# Altium project Jackson.PrjPcb (part 2 of 2)

## Sheet USB Audio.SchDoc
size 420 x 297 mm; SheetNumber: 7; SheetTotal: 7
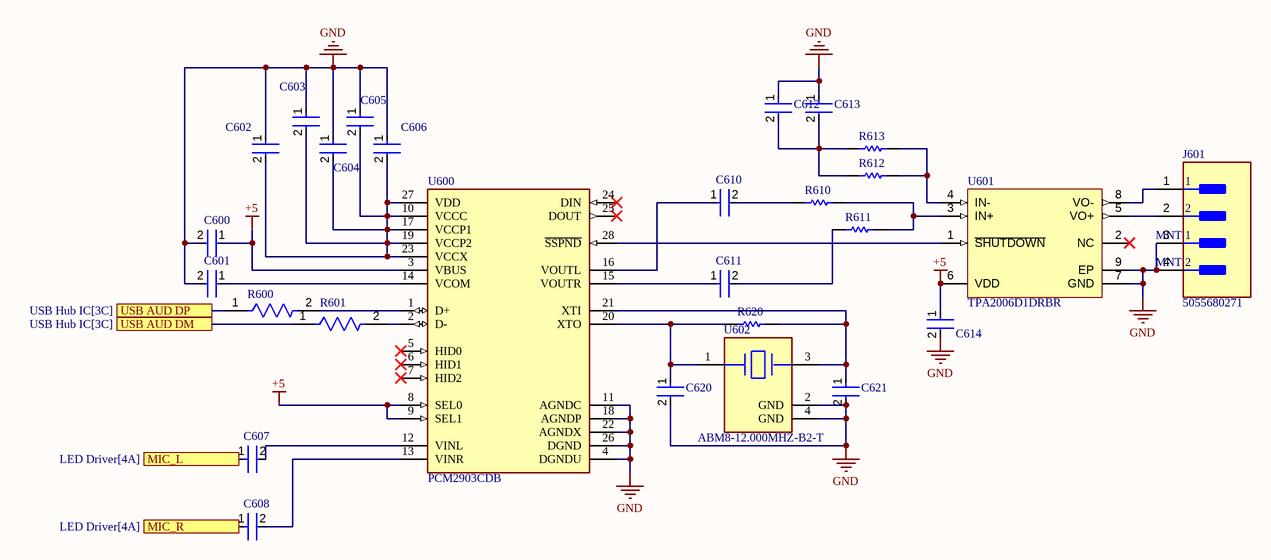
[diagram p6: USB Audio.SchDoc]

### Parts
C600  GRM155R70J105KA12D  [FP-GRM155-0_05-MFG]  (value not drawn)
C601  GRM155R70J105KA12D  [FP-GRM155-0_05-MFG]  (value not drawn)
C602  GRM155R70J105KA12D  [FP-GRM155-0_05-MFG]  (value not drawn)
C603  GRM155R70J105KA12D  [FP-GRM155-0_05-MFG]  (value not drawn)
C604  GRM155R70J105KA12D  [FP-GRM155-0_05-MFG]  (value not drawn)
C605  GRM155R70J105KA12D  [FP-GRM155-0_05-MFG]  (value not drawn)
C606  GRM155R70J105KA12D  [FP-GRM155-0_05-MFG]  (value not drawn)
C607  C0402C103K3RACTU  [FP-C0402-BB-MFG]  (value not drawn)
C608  C0402C103K3RACTU  [FP-C0402-BB-MFG]  (value not drawn)
C610  C0402C103K3RACTU  [FP-C0402-BB-MFG]  (value not drawn)
C611  C0402C103K3RACTU  [FP-C0402-BB-MFG]  (value not drawn)
C612  C0402C103K3RACTU  [FP-C0402-BB-MFG]  (value not drawn)
C613  C0402C103K3RACTU  [FP-C0402-BB-MFG]  (value not drawn)
C614  GRM155R70J105KA12D  [FP-GRM155-0_05-MFG]  (value not drawn)
C620  GJM1555C1H180JB01D  [FP-GJM155-0_05-IPC_B]  (value not drawn)
C621  GJM1555C1H180JB01D  [FP-GJM155-0_05-IPC_B]  (value not drawn)
J601  5055680271  [FP-5055680271-MFG]
R600  ERJ-2RKF27R0X  [FP-ERJ2R-IPC_B]  (value not drawn)
R601  ERJ-2RKF27R0X  [FP-ERJ2R-IPC_B]  (value not drawn)
R610  ERA2AEB683X  [RESC1005X40X25LL10T10]  (value not drawn)
R611  ERA2AEB683X  [RESC1005X40X25LL10T10]  (value not drawn)
R612  ERA2AEB683X  [RESC1005X40X25LL10T10]  (value not drawn)
R613  ERA2AEB683X  [RESC1005X40X25LL10T10]  (value not drawn)
R620  ERJ-2RKF1004X  [RESC1005X40X25LL05T05]  (value not drawn)
U600  PCM2903CDB  [FP-DB0028A-IPC_A]
U601  TPA2006D1DRBR  [DRB0008A_V]
U602  ABM8-12.000MHZ-B2-T  [FP-ABM8-MFG]

### Ports
MIC_L (see LED Driver[4A]), MIC_R (see LED Driver[4A]), USB AUD DM (see USB Hub IC[3C]), USB AUD DP (see USB Hub IC[3C])

### Nets
+5: C600.1 C614.1 U600.3(VBUS) U600.8(SEL0) U600.9(SEL1) U601.6(VDD)
GND: C600.2 C601.2 C602.1 C603.1 C604.1 C605.1 C606.1 C612.1 C613.1 C614.2 C620.2 C621.2 J601.3(MNT_1) J601.4(MNT_2) U600.4(DGNDU) U600.11(AGNDC) U600.18(AGNDP) U600.22(AGNDX) U600.26(DGND) U601.7(GND) U601.9(EP) U602.2(GND) U602.4(GND)
NetC601_1: C601.1 U600.14(VCOM)
NetC602_2: C602.2 C603.2 C604.2 C605.2 C606.2 U600.10(VCCC) U600.17(VCCP1) U600.19(VCCP2) U600.23(VCCX) U600.27(VDD)
NetC607_1: C607.1 ; port MIC_L
NetC607_2: C607.2 U600.12(VINL)
NetC608_1: C608.1 ; port MIC_R
NetC608_2: C608.2 U600.13(VINR)
NetC610_1: C610.1 U600.16(VOUTL)
NetC610_2: C610.2 R610.1
NetC611_1: C611.1 U600.15(VOUTR)
NetC611_2: C611.2 R611.1
NetC612_2: C612.2 C613.2 R612.1 R613.1
NetC620_1: C620.1 R620.1 U600.20(XTO) U602.1
NetC621_1: C621.1 R620.2 U600.21(XTI) U602.3
NetJ601_1: J601.1 U601.8(VO-)
NetJ601_2: J601.2 U601.5(VO+)
NetR600_1: R600.1 ; port USB AUD DP
NetR600_2: R600.2 U600.1(D+)
NetR601_1: R601.1 ; port USB AUD DM
NetR601_2: R601.2 U600.2(D-)
NetR610_2: R610.2 R611.2 U601.3(IN+)
NetR612_2: R612.2 R613.2 U601.4(IN-)
NetU600_28: U600.28(~{SSPND}) U601.1(~{SHUTDOWN})

Not connected (* = marked no-connect by the designer): U600 5(HID0)* 6(HID1)* 7(HID2)* 24(DIN)* 25(DOUT)*; U601 2(NC)*

### Notes on the sheet
- CREATIVE COMMONS
- PUBLIC LICENSE:
- BARKOUR ROBOT
- CC BY-NC 4.0
- APPROVED
- DWG NO
- GOOGLE LLC
- FILE
- RELEASED
- 2024/05/09
- SIZE
- 1600 AMPHITHEATRE PARKWAY
- MOUNTAIN VIEW CA 94043
- A3
- SHEET
- OF
- THIS DESIGN IS BEING PROVIDED  FOR NON-COMMERCIAL USE ONLY. THE USE OF =SCIENTIST_NAME_POSSESSIVE NAME IN CONNECTION WITH THE DESIGN IS NOT INTENDED TO IMPLY THAT =SCIENTIST_NAME SPONSORS OR ENDORSES THE DESIGN, GOOGLE LLC, OR ANY OF GOOGLE LLC'S PRODUCTS OR SERVICES.

### Library data of the parts
C600-C606 C614 = CMP-2008-04587-2: Chip Multilayer Ceramic Capacitors for General Purpose, 0402, 1.0uF, X7R, 15%, 10%, 6.3V; Capacitance: 1uF; Case Code (Metric): 1005; Min Operating Temperature: -55°C; Tolerance: 10%; Depth: 0.5mm; Max Operating Temperature: 125°C; Width: 0.5mm; Case Code (Imperial): 0402; Termination: SMD/SMT; Weight: 0.000212oz; Thickness: 0.022inch; Package Quantity: 10000; Packaging: Tape and Reel; Voltage Rating: 6.3V; Lead Free: Lead Free; Height: 0.5mm; Length: 1mm; Dielectric: X7R; Case/Package: 0402; Voltage Rating (DC): 6.3V; Material: Ceramic; Mount: Surface Mount
C607 C608 C610-C613 = CMP-2008-03070-3: Multilayer Ceramic Capacitors MLCC - SMD/SMT 25volts 10000pF X7R 10%; Manufacturer: Kemet; Tolerance: 0.1; Temperature Coefficient: 15%; Voltage Rating: 25 V; Capacitance: 10,000 pF; Value: 10,000 pF; Manufacturer Part Number: C0402C103K3RACTU; Digikey Description: Multilayer Ceramic Capacitors MLCC - SMD/SMT 25volts 10000pF X7R 10%; Temperature Range Low: -55°C; Octopart: https://octopart.com/c0402c103k3ractu-kemet-129636; Material: Ceramic; Automotive: No; Ipc Land Pattern Name: CAPC10050X50; Temperature: -55°C to +125°C; Height: 0.55mm; Package: C0402-BB; RoHS: TRUE; Device Class L2: Capacitors; Lead Free: Yes; Device Class L3: Ceramic Capacitors; ComponentLink2Description: Datasheet; Device Class L1: Passive Components; Temperature Range High: +125°C; ComponentLink2URL: https://content.kemet.com/datasheets/KEM_C1002_X7R_SMD.pdf; Category: Cap; Temperature Characteristic: X7R
C620 C621 = CMP-2008-03807-2: Multi-Layer Ceramic Capacitor 18pF C0G  ±5% 0402 Paper T/R; Voltage: 50V; Radiation Hardening: No; Capacitance: 18pF; Depth: 0.5mm; Voltage Rating: 50V; Case/Package: 0402; Tolerance: 5%; Packaging: Tape and Reel; Height: 0.5mm; Case Code (Imperial): 0402; Width: 0.02inch; Lead Free: Lead Free; Dielectric: C0G; Package Quantity: 1; Max Operating Temperature: 125°C; Thickness: 0.022inch; Termination: SMD/SMT; Length: 1mm; Min Operating Temperature: -55°C; Mount: Surface Mount; Voltage Rating (DC): 50V; Case Code (Metric): 1005
J601 = CMP-04776-000038-1: CONN HEADER SMD 2POS 1.25MM; Manufacturer: molex; Current Rating: 1.5A; Number Of Contacts: 2; Conn Gender: Male; Conn Orientation: Vertical; Voltage Rating: 50V; Footprint Url: https://www.molex.com/pdm_docs/sd/5055680271_sd.pdf; Lead Free: Yes; Number Of Rows: 1; Temperature: -40°C to +105°C; Digikey Description: CONN HEADER SMD 2POS 1.25MM; RoHS: TRUE; Temperature Range High: +105°C; Package: 0; Temperature Range Low: -40°C; Octopart: https://octopart.com/505568-0271-molex-84869617; Height: 4.4mm; Pitch: 1.25mm; Device Class L2: Headers and Wire Housings; Manufacturer Part Number: 5055680271; Device Class L1: Connectors; Contact Material: Tin,Nickel; Device Class L3: unset; Automotive: No; ComponentLink2URL: https://www.molex.com/webdocs/datasheets/pdf/en-us/5055680271_PCB_HEADERS.pdf; ComponentLink2Description: Datasheet; Category: Conn
R600 R601 = CMP-2002-00830-2: RES SMD 27 OHM 1% 1/10W 0402; Voltage Rating: 50V; Temperature Coefficient: 100ppm/°C; Resistance: 27R; Power Rating: 100mW; Military Standard: Not; Construction: Rectangular; Tolerance: 1%; Features: Automotive AEC-Q200; Length: 1mm; Lead Free: Lead Free; Mount: Surface Mount; Number of Terminations: 2; Radiation Hardening: No; Number of Pins: 2; Width: 0.5mm; Contact Plating: Tin; Voltage Rating (DC): 50V; Resistance Tolerance: 1%; Series: ERJ; Packaging: Tape and Reel; Case/Package: 0402; Technology: THICK FILM; REACH SVHC: No SVHC; Depth: 0.5mm; Resistor Type: Thick Film; Package Quantity: 1; Termination: SMD/SMT; Case Code (Imperial): 0402; Height: 0.35mm; Weight: 2.8E-05oz; Max Operating Temperature: 155°C; Case Code (Metric): 1005; Min Operating Temperature: -55°C; RoHS Compliant: Yes; Max Power Dissipation: 100mW
R610-R613 = CMP-2002-05893-1: Manufacturer: Panasonic; Part Number: ERA2AEB683X
R620 = CMP-2002-00609-3: Chip Resistor, 1 MOhm, +/- 1%, 100 mW, -55 to 155 degC, 0402 (1005 Metric), RoHS, Tape and Reel; Manufacturer: Basic Passives; Voltage Rating: 50 V; Case\/Package: 0402; Resistance: 1 MOhm; Power Rating: 100 mW; Pins: 2; Max Operating Temperature: 155 degC; ComponentLink2URL: http://industrial.panasonic.com/cdbs/www-data/pdf/RDA0000/AOA0000C86.pdf; Weight: 2.8E-05oz; ComponentLink1URL: http://www.panasonic.com/; Radiation Hardening: No; Height: 0.35 mm; Case Code (Imperial): 0402; ComponentLink2Description: Datasheet; Mount: Surface Mount; ComponentLink1Description: Manufacturer URL; REACH SVHC: Yes; PartNumber: ERJ-2RKF1004X; Length: 1 mm; Min Operating Temperature: -55 degC; Width: 0.5 mm; Package Quantity: 10000; Tolerance: 1%; PackageDescription: 2-Pin Surface Mount Device, Body 1 x 0.5 mm; RoHSCompliant: true; DatasheetVersion: 04/2015; PackageReference: 0402; Mounting Technology: Surface Mount; Case Code (Metric): 1005; Packaging: Tape and Reel
U600 = CMP-04873-000010-1: IC STERO AUD CODEC W/USB 28SSOP; Supply Current: 70mA; Max Supply Voltage: 3.6V; Number of DAC Channels: 2; Min Supply Voltage: 3V; Operating Supply Voltage: 3.3V; Resolution: 16b; Interface: USB; Sampling Rate: 48KS/s; Signal to Noise Ratio (SNR): 89dB; Nominal Supply Current: 70mA; Series: -; Radiation Hardening: No; Number of ADC Channels: 2; Package Quantity: 50; RoHS Compliant: Yes; Number of D/A Converters: 2; Number of A/D Converters: 2; Packaging: Rail/Tube; Number of Analog Outputs: 2; Mount: Surface Mount; Max Operating Temperature: 85°C; REACH SVHC: No SVHC; Min Operating Temperature: -25°C; Lead Free: Lead Free; Number of Analog Inputs: 2; Number of Pins: 28; Case/Package: SSOP
U601 = CMP-0991-00129-2: 1.45-W Mono Class-D Audio Amplifier with 1.8 V Compatible Shutdown Voltage, -40 to 85 degC, 8-pin SON (DRB8), Green (RoHS & no Sb/Br); Manufacturer: Texas Instruments; Supply Min(Min)(Volt): 2.5; Supply Max(Max)(Volt): 5.5; PSRR(dB): -75; SubFamily: Dynamic Speaker; Output Power(W): 1.45; ComponentLink1Description: Manufacturer URL; ComponentLink3Description: Package Specification; Speaker Amp Type: Class-D; ComponentLink2Description: Datasheet; PartNumber: TPA2006D1DRBR; ComponentLink3URL: http://www.ti.com/litv/pdf/mpds118h; Mounting Technology: Surface Mount; PackageVersion: 4203482-2/K, 06/2012; PackageDescription: 8-Pin Plastic Small Outline, Body 3 x 3 mm, Pitch 0.65 mm; Eco-Plan: Green (RoHS & no Sb/Br); DatasheetVersion: SLOS498A; ComponentLink1URL: http://www.ti.com/; ComponentLink2URL: http://www.ti.com/general/docs/lit/getliterature.tsp?genericPartNumber=TPA2006D1&fileType=pdf; Speaker Channels: Mono; PackageReference: DRB0008A
U602 = CMP-27762-003220-1: Crystal 12MHz ±20ppm 18pF SMD-4 3.2mm x 2.5mm; ESR (Equivalent Series Resistance): 120R; Frequency Stability: 50ppm; Operating Frequency: 12 MHz; Resistor Type: Ceramic; Tolerance: 20ppm; Load Capacitance: 18pF; Frequency Tolerance: 20ppm; Packaging: Tape and Reel; Frequency: 12MHz; Number of Pins: 4; Case/Package: CSMD; Max Operating Temperature: 70°C; Mount: Surface Mount; Package Quantity: 1000; Radiation Hardening: No; Min Operating Temperature: -20°C; Width: 0.098inch; Lead Free: Lead Free; Height: 0.031inch; Depth: 2.5mm; REACH SVHC: No SVHC; Series: ABM8; Series Resistance: 120R; Length: 3.2mm; Termination: SMD/SMT; RoHS Compliant: Yes

## Nets that join several sheets
+1.1: USB Hub (9 pins), USB Hub IC (7 pins)
+3.3: USB Hub (11 pins), USB Hub IC (6 pins), LED Driver (11 pins), USB to UART (C101.2 C102.2 U101.10), STO (C331.2 L331.2 U303.4)
+5: USB Hub (6 pins), USB Hub IC (R5.1), LED Driver (5 pins), USB to UART (R105.2 R106.2 R111.2 R112.2), STO (C330.1 C332.2 U303.1 U303.3), USB 3 (J20.2A4 J20.2A9), USB Audio (6 pins)
Dynamixel 12V: USB to UART (J11.2), STO (C334.1 F302.2 R52.2 U301.7)
GND: USB Hub (25 pins), USB Hub IC (9 pins), LED Driver (16 pins), USB to UART (9 pins), STO (9 pins), USB 3 (5 pins), USB Audio (23 pins)
NetC607_1: LED Driver (J21.4 R212.2), USB Audio (C607.1)
NetC608_1: LED Driver (J21.2 R211.2), USB Audio (C608.1)
NetFB1_1: USB Hub (FB1.1 J20.B4 J20.B9), USB 3 (J20.A4 J20.A9)
NetR600_1: USB Hub IC (U1.56), USB Audio (R600.1)
NetR601_1: USB Hub IC (U1.57), USB Audio (R601.1)
USB_I2C_N: USB Hub IC (U1.50), LED Driver (R201.1)
USB_I2C_P: USB Hub IC (U1.49), LED Driver (R202.1)
USB_IN_N: USB Hub (J20.B7 R2.1 U10.3), USB 3 (J20.A7)
USB_IN_P: USB Hub (J20.B6 R1.1 U10.2 U10.5), USB 3 (J20.A6)
USB_UART_N: USB Hub IC (U1.42), USB to UART (R101.1)
USB_UART_P: USB Hub IC (U1.41), USB to UART (R102.1)
USBCIN_N: USB Hub (R4.1), USB Hub IC (U1.34)
USBCIN_P: USB Hub (R3.1), USB Hub IC (U1.33)
USBIN_N: USB Hub (R2.2), USB Hub IC (U1.22)
USBIN_P: USB Hub (R1.2), USB Hub IC (U1.21)
USBOUT_N: USB Hub (J20.2B7 R4.2 U11.2 U11.5), USB 3 (J20.2A7)
USBOUT_P: USB Hub (J20.2B6 R3.2 U11.3), USB 3 (J20.2A6)